# Altium schematic sheet Current&Voltage-acq.SchDoc
size A4; SheetNumber: 2; SheetTotal: 2; SPICEModelCacheRCVEYUVS: <root> / <DocumentId>RCVEYUVS</DocumentId> / </root>
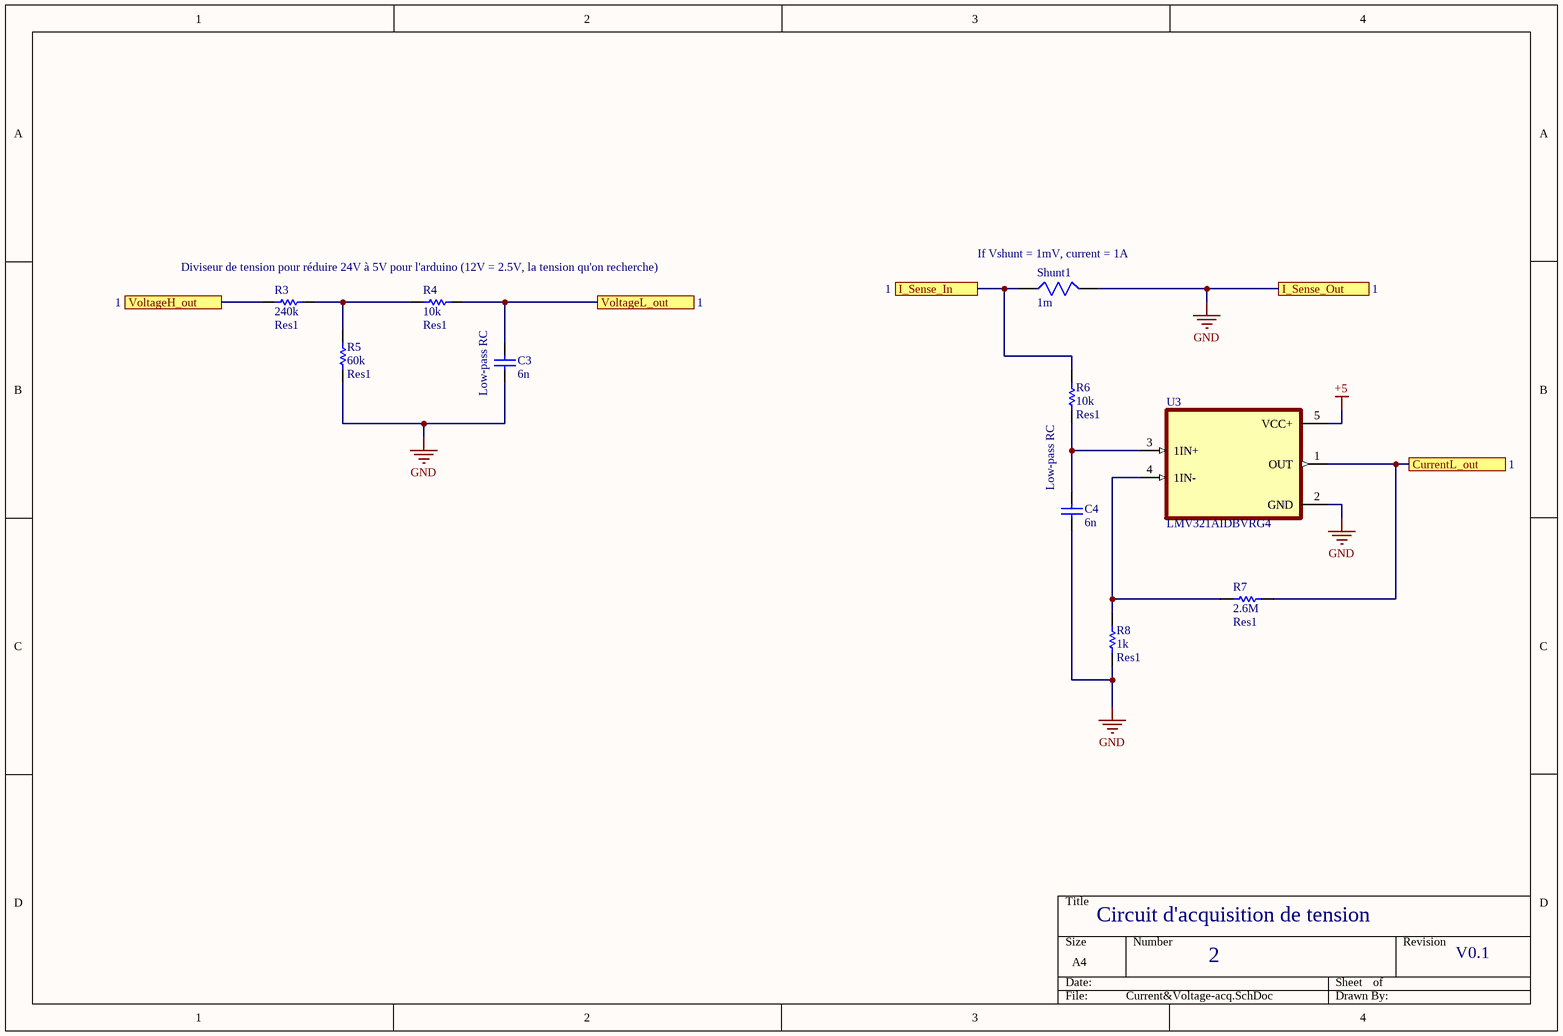
[diagram p0: Current&Voltage-acq.SchDoc]

## Parts
C3  value 6n  [C1206]  (hidden comment: Ceramic Capacitor)
C4  value 6n  [C1206]  (hidden comment: Ceramic Capacitor)
R3  Res1  value 240k  [AXIAL-0.3]
R4  Res1  value 10k  [AXIAL-0.3]
R5  Res1  value 60k  [AXIAL-0.3]
R6  Res1  value 10k  [AXIAL-0.3]
R7  Res1  value 2.6M  [AXIAL-0.3]
R8  Res1  value 1k  [AXIAL-0.3]
Shunt1  1m  [resistor_1206]
U3  LMV321AIDBVRG4  [SOT95P280X145-5N]

## Ports
CurrentL_out (see 1), I_Sense_In (see 1), I_Sense_Out (see 1), VoltageH_out (see 1), VoltageL_out (see 1)

## Nets
+5: U3.5(VCC+)
GND: C3.1 C4.1 R5.2 R8.2 Shunt1.2 U3.2(GND) ; port I_Sense_Out
CurrentL_out: R7.2 U3.1(OUT) ; port CurrentL_out
I_Sense_In: R6.1 Shunt1.1 ; port I_Sense_In
VoltageH_out: R3.1 ; port VoltageH_out
VoltageL_out: C3.2 R4.2 ; port VoltageL_out
NetC4_2: C4.2 R6.2 U3.3(1IN+)
NetR3_2: R3.2 R4.1 R5.1
NetR7_1: R7.1 R8.1 U3.4(1IN-)

## Notes on the sheet
- Diviseur de tension pour réduire 24V à 5V pour l'arduino (12V = 2.5V, la tension qu'on recherche)
- (near Shunt1) If Vshunt = 1mV, current = 1A
- (near C3) Low-pass RC
- Low-pass RC
- Circuit d'acquisition de tension
- V0.1

## Library data of the parts
C3 C4 = Cap Semi: Capacitor (Semiconductor SIM Model); Published: 8-Jun-2000; LatestRevisionDate: 29-May-2009; LatestRevisionNote: IPC-7351 Footprint Added.; PackageReference: C1206; Publisher: Altium Limited; PackageDescription: Chip Capacitor
R3-R8 = Res1: Resistor; Published: 8-Jun-2000; LatestRevisionDate: 17-Jul-2002; LatestRevisionNote: Re-released for DXP Platform.; PackageReference: AXIAL-0.3; Publisher: Altium Limited; PackageDescription: Axial Device, Thru-Hole; 2 Leads; 0.3 in Pin Spacing
Shunt1 = resistor
U3 = LMV321AIDBVRG4: Single Low-Voltage Rail-to-Rail Output Operational Amplifier see LMV321A for upgraded version 5-SOT-23 -40 to 125; MF: Texas Instruments; MP: LMV321IDBVRG4; SnapEDA_Link: https://www.snapeda.com/parts/LMV321IDBVRG4/Texas+Instruments/view-part/?ref=snap; Package: SOT-23-5 Texas Instruments; Value: *; Check_prices: https://www.snapeda.com/parts/LMV321IDBVRG4/Texas+Instruments/view-part/?ref=eda